# Altium schematic sheet 1_P1.schdoc
size 307 x 218 mm; Symbol: Drawing-Symbol_A4; Device: Drawing-Symbol_A4; @Project Name: NFC card; @Page Count: 1; @Update Date: 2025-12-13; @Create Date: 2025-12-13; @Schematic Name: Schematic1; @Page No: 1; @Page Name: P1; Company: EasyEDA.com; Version: V1.0; Page Size: A4; @Create Time: 20:01:40; @Update Time: 15:01:40; Width: 1170; Height: 825; Region Start: 1; X Region Count: 6; Y Region Count: 4; Blade Width: 10; Title Block Position: 3; @Board Name: Board1
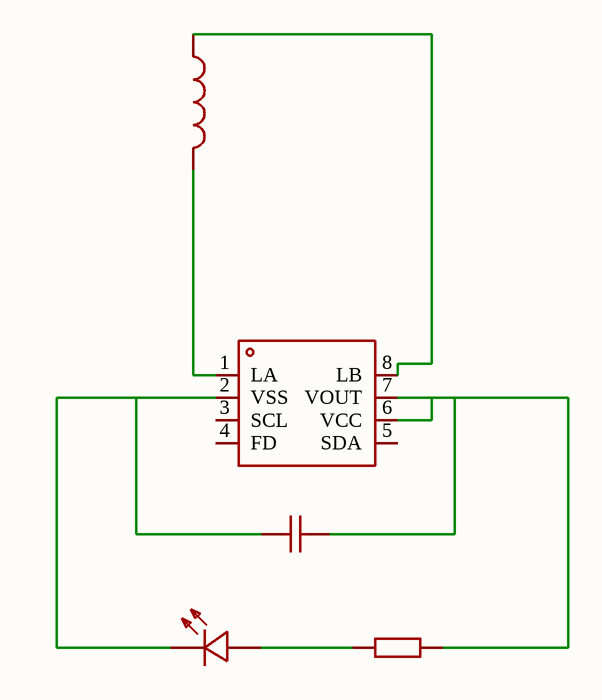
[diagram p0: 1_P1.schdoc]

## Parts
C1  220nF  [C0603]  (value not drawn)
LED1  KT-0805Y  [LED0805-R-RD]  (value not drawn)
R1  47Ω  [R0603]  (value not drawn)
U1  13.56MHz  [XQFN-8_L1.6-W1.6-P0.50-BL_NT3H2111W0FHKH]  (value not drawn)
U2  25X48MM_NFC_ANTENNA  [25X48MM_NFC_ANTENNA]  (value not drawn)

## Nets
NetC1_1: C1.1 LED1.2(-) U1.2(VSS)
NetC1_2: C1.2 R1.2 U1.6(VCC) U1.7(VOUT)
NetLED1_1: LED1.1(+) R1.1
NetU1_1: U1.1(LA) U2.P$2
NetU1_8: U1.8(LB) U2.P$1

Not connected (* = marked no-connect by the designer): U1 3(SCL) 4(FD) 5(SDA)

## Notes on the sheet
- 1
- 2
- 3
- 4
- 5
- 6
- A
- B
- C
- Schematic
- Schematic1
- Create at
- Update at
- 2025-12-13
- Board
- Drawn
- Board1
- Page
- P1
- D
- Reviewed
- Version
- Size
- NFC card
- Page  1  Total  1
- V1.0
- A4
- EasyEDA.com

## Library data of the parts
C1 = CL10B224KA8NNNC: Manufacturer: SAMSUNG(三星); Add into BOM: yes; Tolerance: ±10%; Voltage Rating: 25V; Temperature Coefficient: X7R; Symbol: CL10B224KA8NNNC; Device: CL10B224KA8NNNC; LCSC Part Name: 220nF ±10% 25V; Supplier Part: C21120; Manufacturer Part: CL10B224KA8NNNC; Supplier Footprint: 0603; JLCPCB Part Class: Basic Part; Datasheet: https://item.szlcsc.com/datasheet/CL10B224KA8NNNC/21832.html; Supplier: LCSC; Convert to PCB: yes; Value: 220nF
LED1 = KT-0805Y: Manufacturer: KENTO; Symbol: 17-21SUYC/TR8; Add into BOM: yes; Illumination Color: Yellow; Voltage - Forward(Vf): 1.8V~2.4V; Power(Watts): 40mW; Wavelength - Dominant: 584nm~594nm; Peak Wavelength: 596nm; Lens Color: Water Clear; Luminous Intensity: 175mcd; Viewing Angle: 120°; Device: KT-0805Y; LCSC Part Name: 0805 黄灯 高亮; Supplier Part: C2296; Manufacturer Part: KT-0805Y; Supplier Footprint: 0805; JLCPCB Part Class: Basic Part; Datasheet: https://item.szlcsc.com/datasheet/KT-0805Y/2669.html; Supplier: LCSC; Convert to PCB: yes; Forward Current: -; Diode Configuration: -; Color Temperature: -; Mounting Style: -; Operating Temperature: -40℃~+85℃
R1 = 0603WAF470JT5E: Manufacturer: UNI-ROYAL(厚声); Add into BOM: yes; Tolerance: ±1%; Power(Watts): 100mW; Voltage-Supply(Max): 75V; Temperature Coefficient: ±100ppm/℃; Symbol: 0603WAF470JT5E; Device: 0603WAF470JT5E; Supplier: LCSC; Manufacturer Part: 0603WAF470JT5E; Supplier Part: C23182; Value: 47Ω; JLCPCB Part Class: Basic Part; LCSC Part Name: 47Ω ±1% 100mW 厚膜电阻; Supplier Footprint: 0603; Datasheet: https://item.szlcsc.com/datasheet/0603WAF470JT5E/23909.html; Convert to PCB: yes; Type: Thick Film Resistor; Operating Temperature: -55℃~+155℃
U1 = NT3H2111W0FHKH: Manufacturer: NXP(恩智浦); Add into BOM: yes; agreement: ISO 14443; interface type: I2C; mains input: 3.3V; Symbol: NT3H2111W0FHKH; Device: NT3H2111W0FHKH; LCSC Part Name: NT3H2111W0FHKH; Supplier Part: C710403; Manufacturer Part: NT3H2111W0FHKH; Supplier Footprint: XQFN-8(1.6x1.6); JLCPCB Part Class: Extended Part; Datasheet: https://www.nxp.com/docs/en/data-sheet/NT3H2111_2211.pdf; Supplier: LCSC; Convert to PCB: yes; Value: 13.56MHz
U2 = 25X48MM_NFC_ANTENNA: Add into BOM: yes; Symbol: 25X48MM_NFC_ANTENNA; Device: 25X48MM_NFC_ANTENNA; Convert to PCB: yes